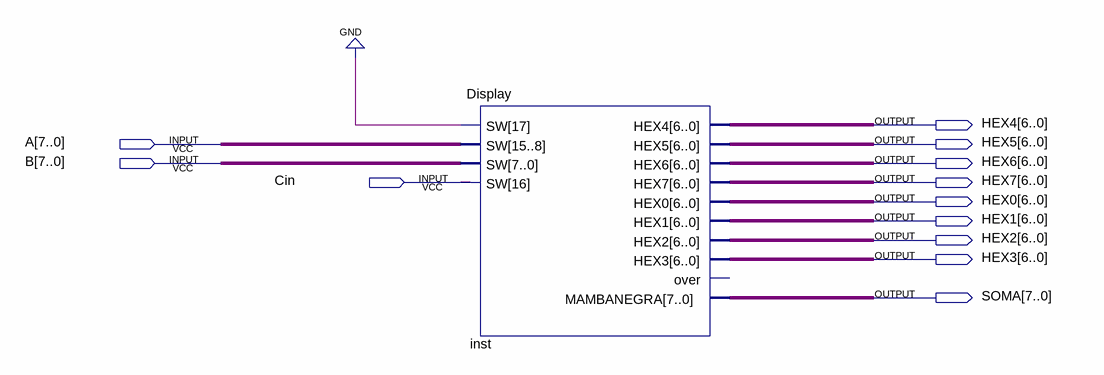
[diagram p0: schematic sheet]
// Quartus schematic Calculadora.bdf as structural Verilog: 1 symbols, 12 pins
module Calculadora (
  input  [7:0] A,
  input  [7:0] B,
  input  Cin,
  output [6:0] HEX4,
  output [6:0] HEX5,
  output [6:0] HEX6,
  output [6:0] HEX7,
  output [6:0] HEX0,
  output [6:0] HEX1,
  output [6:0] HEX2,
  output [6:0] HEX3,
  output [7:0] SOMA
);

  Display inst (
    .SW({1'b0, Cin, A, B}), .HEX4(HEX4), .HEX5(HEX5), .HEX6(HEX6), .HEX7(HEX7), .HEX0(HEX0), .HEX1(HEX1),
    .HEX2(HEX2), .HEX3(HEX3), .MAMBANEGRA(SOMA));  // open: over
endmodule
